# EAGLE design Pure VCF (EAGLE 9.6.2)
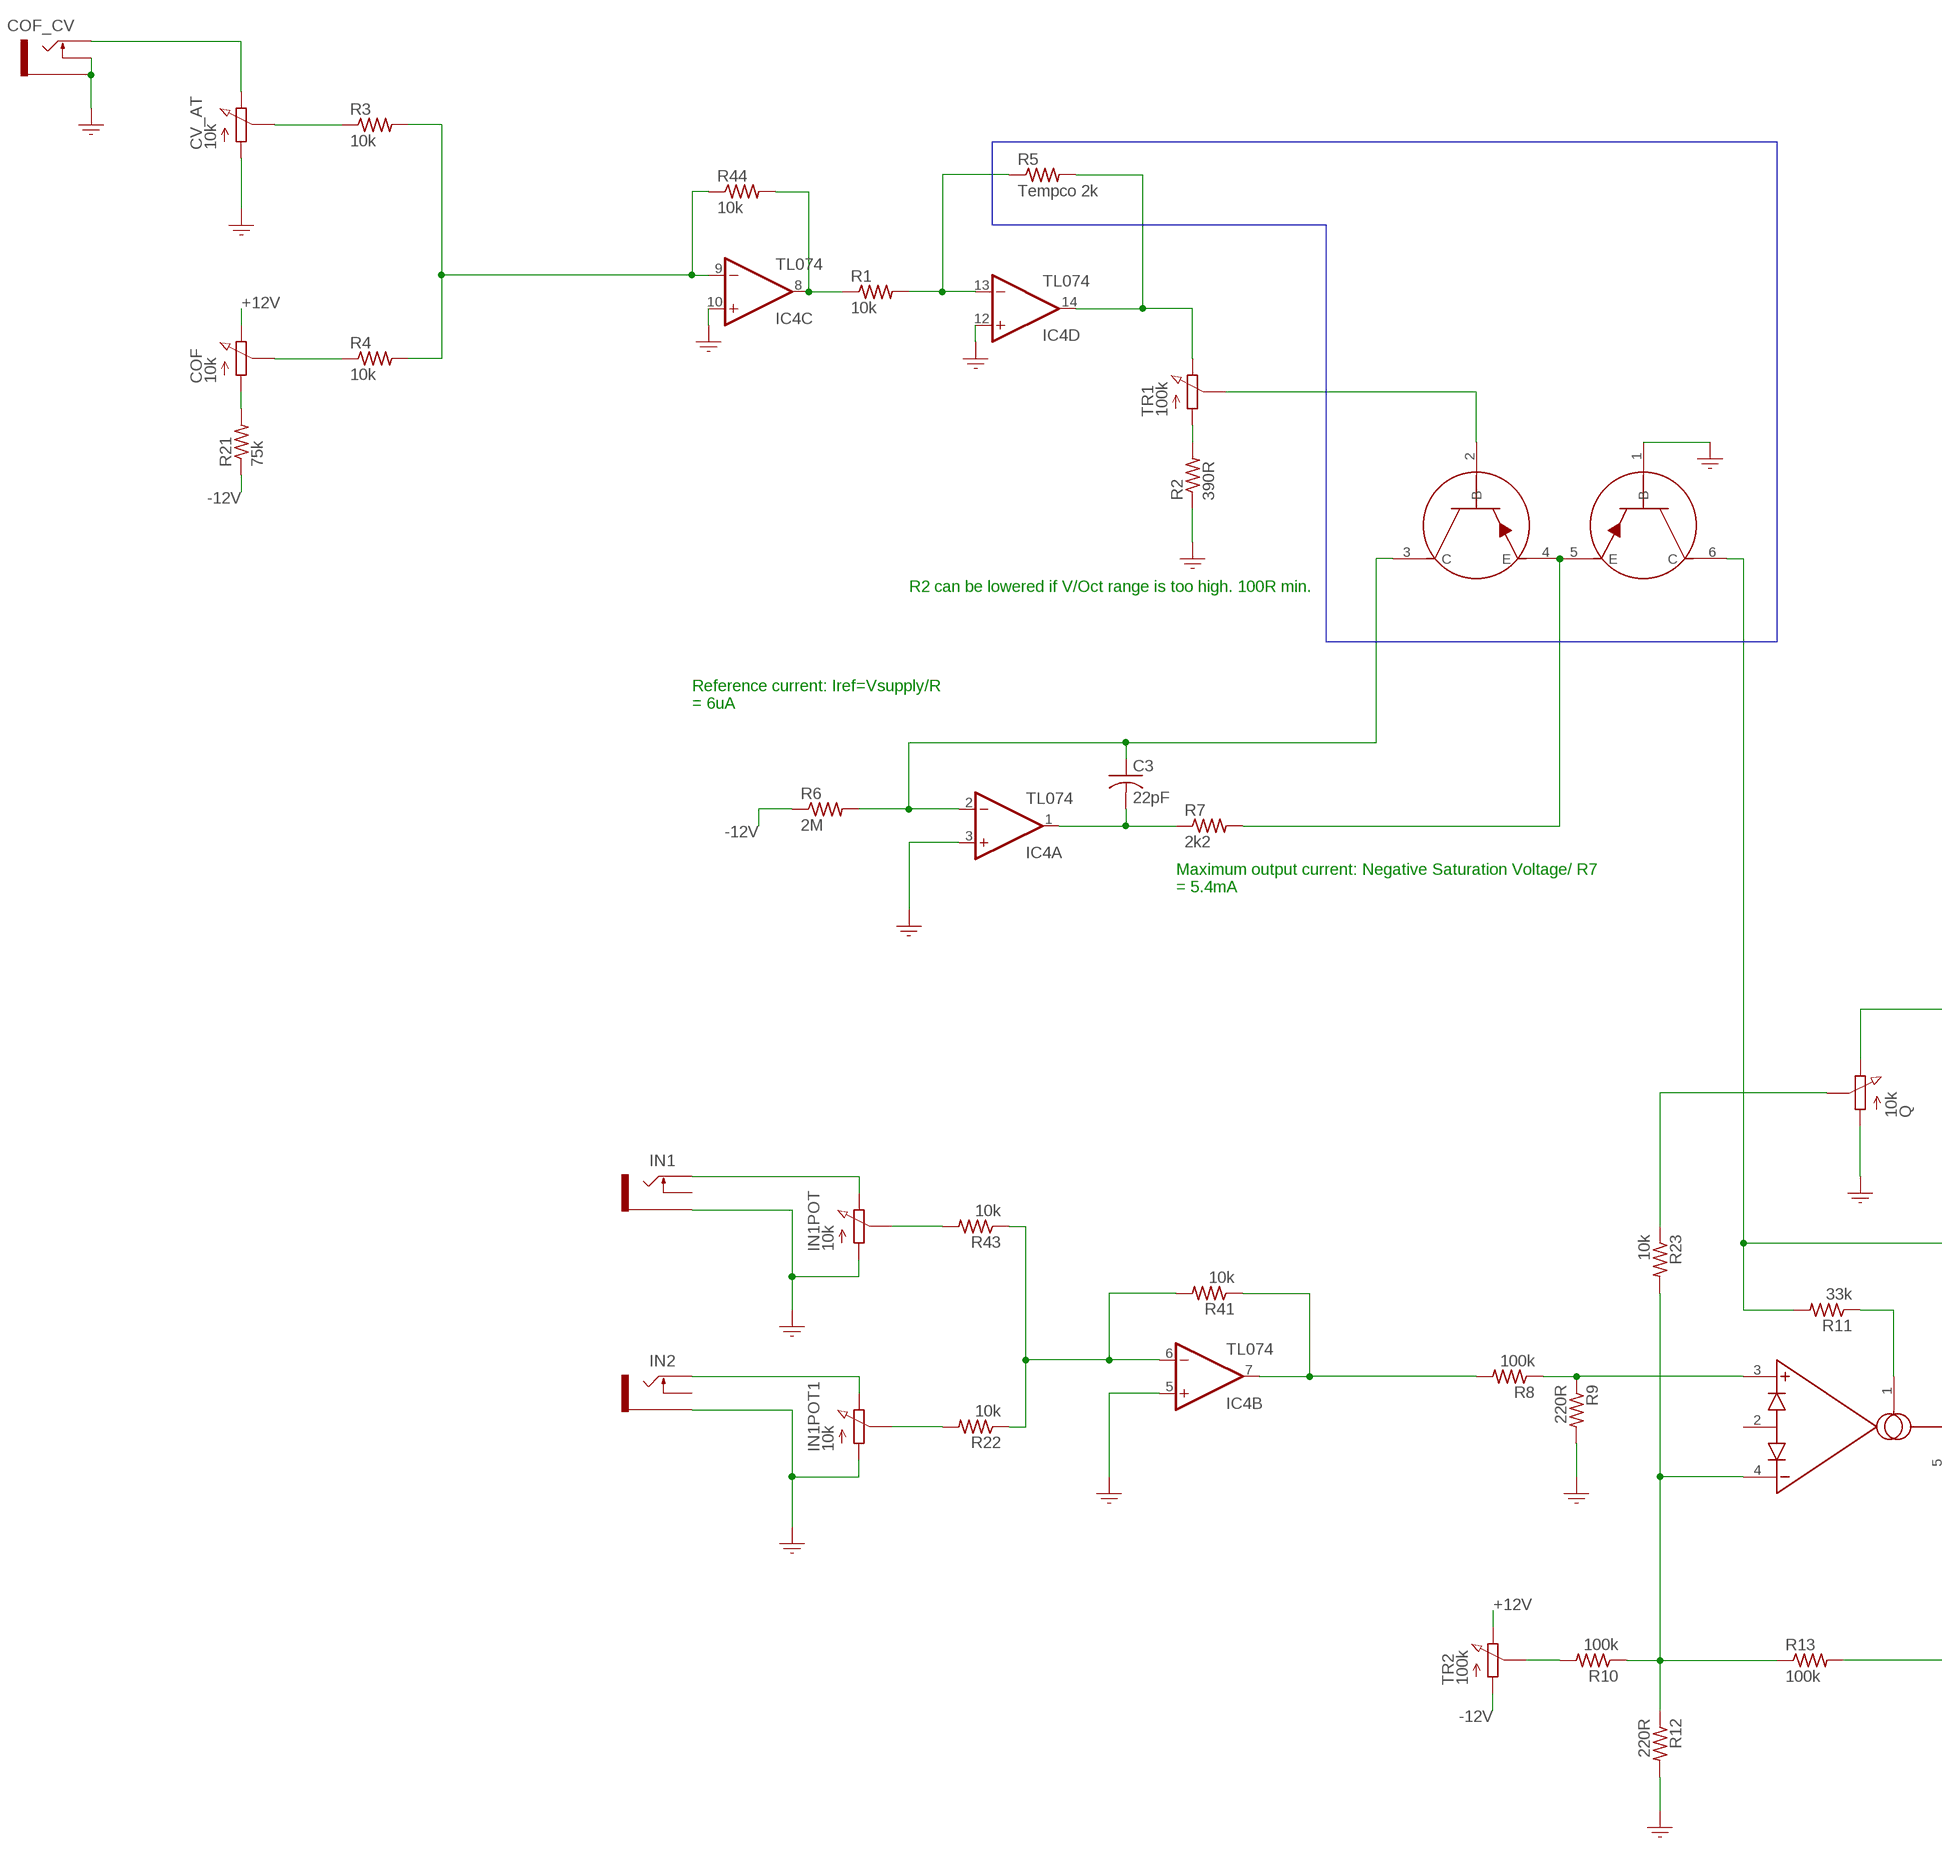
[diagram p0: schematic, sheet 1, part 1 of 2]
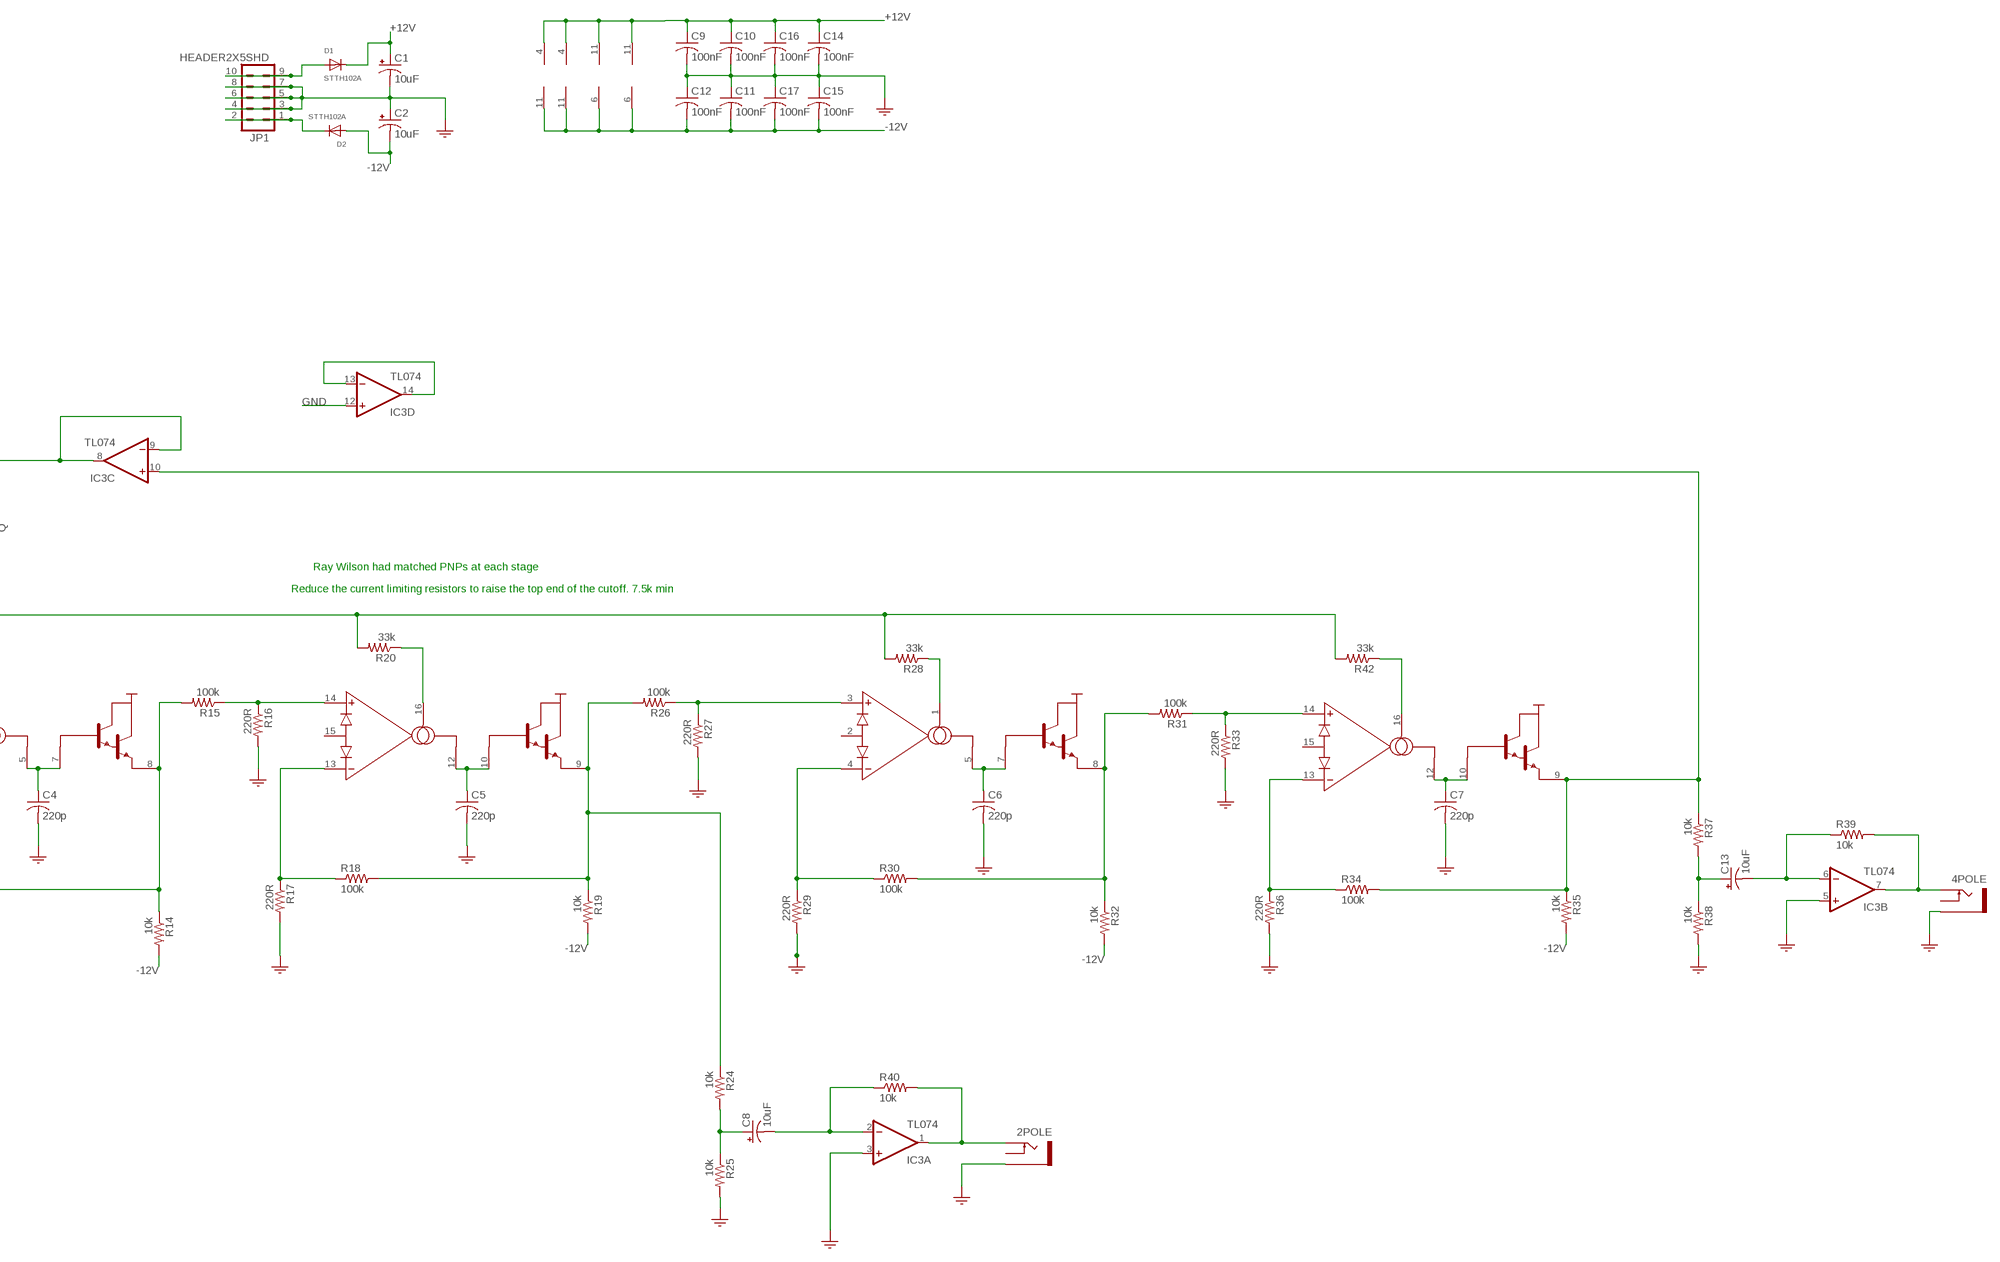
[diagram p1: schematic, sheet 1, part 2 of 2]

## Parts
2POLE  PJ301M-12  SOCKET_MONO_3.5MMPJ301M-12  [PJ301M-12]
4POLE  PJ301M-12  SOCKET_MONO_3.5MMPJ301M-12  [PJ301M-12]
C1  10uF  CAPACITOR_POL-US153CLV-0505  [153CLV-0505]
C2  10uF  CAPACITOR_POL-US153CLV-0505  [153CLV-0505]
C3  22pF  CAPACITOR-USC0805  [C0805]
C4  220p  CAPACITOR-USC050-045X075  [C050-045X075]
C5  220p  CAPACITOR-USC050-045X075  [C050-045X075]
C6  220p  CAPACITOR-USC050-045X075  [C050-045X075]
C7  220p  CAPACITOR-USC050-045X075  [C050-045X075]
C8  10uF  CAPACITOR_POL-US153CLV-0505  [153CLV-0505]
C9  100nF  CAPACITOR-USC0805  [C0805]
C10  100nF  CAPACITOR-USC0805  [C0805]
C11  100nF  CAPACITOR-USC0805  [C0805]
C12  100nF  CAPACITOR-USC0805  [C0805]
C13  10uF  CAPACITOR_POL-US153CLV-0505  [153CLV-0505]
C14  100nF  CAPACITOR-USC0805  [C0805]
C15  100nF  CAPACITOR-USC0805  [C0805]
C16  100nF  CAPACITOR-USC0805  [C0805]
C17  100nF  CAPACITOR-USC0805  [C0805]
COF  10k  RESISTOR_VARIABLEPOT_9MM_RED_KNOB  [POT_9MM_RED_KNOB]
COF_CV  PJ301M-12  SOCKET_MONO_3.5MMPJ301M-12  [PJ301M-12]
CV_AT  10k  RESISTOR_VARIABLEPOT_9MM_GREEN_KNOB  [POT_9MM_GREEN_KNOB]
D1  STTH102A  DIODESMA  [SMADIODE]
D2  STTH102A  DIODESMA  [SMADIODE]
IC1  LM13700  OTA_LM13700  [SOIC-16_BLANK]
IC2  LM13700  OTA_LM13700  [SOIC-16_BLANK]
IC3  TL074  OPAMP_QUADD  [SO14]
IC4  TL074  OPAMP_QUADD  [SO14]
IN1  PJ301M-12  SOCKET_MONO_3.5MMPJ301M-12  [PJ301M-12]
IN1POT  10k  RESISTOR_VARIABLEPOT_9MM_BLUE_KNOB  [POT_9MM_BLUE_KNOB]
IN1POT1  10k  RESISTOR_VARIABLEPOT_9MM_BLUE_KNOB  [POT_9MM_BLUE_KNOB]
IN2  PJ301M-12  SOCKET_MONO_3.5MMPJ301M-12  [PJ301M-12]
JP1  HEADER2X5SHD  [2X5-SHROUDED]
Q  10k  RESISTOR_VARIABLEPOT_9MM_YELLOW_KNOB  [POT_9MM_YELLOW_KNOB]
R1  10k  RESISTOR_USR0805  [R0805]
R2  390R  RESISTOR_USR0805  [R0805]
R3  10k  RESISTOR_USR0805  [R0805]
R4  10k  RESISTOR_USR0805  [R0805]
R5  Tempco 2k  RESISTOR_US0207/8.5  [0207/8.5]
R6  2M  RESISTOR_USR0805  [R0805]
R7  2k2  RESISTOR_USR0805  [R0805]
R8  100k  RESISTOR_USR0805  [R0805]
R9  220R  RESISTOR_USR0805  [R0805]
R10  100k  RESISTOR_USR0805  [R0805]
R11  33k  RESISTOR_USR0805  [R0805]
R12  220R  RESISTOR_USR0805  [R0805]
R13  100k  RESISTOR_USR0805  [R0805]
R14  10k  RESISTOR_USR0805  [R0805]
R15  100k  RESISTOR_USR0805  [R0805]
R16  220R  RESISTOR_USR0805  [R0805]
R17  220R  RESISTOR_USR0805  [R0805]
R18  100k  RESISTOR_USR0805  [R0805]
R19  10k  RESISTOR_USR0805  [R0805]
R20  33k  RESISTOR_USR0805  [R0805]
R21  75k  RESISTOR_USR0805  [R0805]
R22  10k  RESISTOR_USR0805  [R0805]
R23  10k  RESISTOR_USR0805  [R0805]
R24  10k  RESISTOR_USR0805  [R0805]
R25  10k  RESISTOR_USR0805  [R0805]
R26  100k  RESISTOR_USR0805  [R0805]
R27  220R  RESISTOR_USR0805  [R0805]
R28  33k  RESISTOR_USR0805  [R0805]
R29  220R  RESISTOR_USR0805  [R0805]
R30  100k  RESISTOR_USR0805  [R0805]
R31  100k  RESISTOR_USR0805  [R0805]
R32  10k  RESISTOR_USR0805  [R0805]
R33  220R  RESISTOR_USR0805  [R0805]
R34  100k  RESISTOR_USR0805  [R0805]
R35  10k  RESISTOR_USR0805  [R0805]
R36  220R  RESISTOR_USR0805  [R0805]
R37  10k  RESISTOR_USR0805  [R0805]
R38  10k  RESISTOR_USR0805  [R0805]
R39  10k  RESISTOR_USR0805  [R0805]
R40  10k  RESISTOR_USR0805  [R0805]
R41  10k  RESISTOR_USR0805  [R0805]
R42  33k  RESISTOR_USR0805  [R0805]
R43  10k  RESISTOR_USR0805  [R0805]
R44  10k  RESISTOR_USR0805  [R0805]
T1  DMMT3906W  TRANSISTOR_PAIR_PNP  [TRANS_PAIR]
TR1  100k  RESISTOR_VARIABLETRIMMER_TH  [TRIMMER_TH]
TR2  100k  RESISTOR_VARIABLETRIMMER_TH  [TRIMMER_TH]

## Nets
+12V: C1.+ C9.1 C10.1 C14.1 C16.1 COF.P$3 D1.C IC1.11(V+) IC2.11(V+) IC3.4(P:V+) IC4.4(P:V+) TR2.3
-12V: C2.- C11.2 C12.2 C15.2 C17.2 D2.A IC1.6(V-) IC2.6(V-) IC3.11(P:V-) IC4.11(P:V-) R6.1 R14.2 R19.2 R21.1 R32.2 R35.2 TR2.1
GND: 2POLE.GND(SLEEVE) 4POLE.GND(SLEEVE) C1.- C2.+ C4.2 C5.2 C6.2 C7.2 C9.2 C10.2 C11.1 C12.1 C14.2 C15.1 C16.2 C17.1 COF_CV.GND(SLEEVE) COF_CV.NORM(SWITCH) CV_AT.P$1 IC3.3(A:+IN) IC3.5(B:+IN) IC3.12(D:+IN) IC4.3(A:+IN) IC4.5(B:+IN) IC4.10(C:+IN) IC4.12(D:+IN) IN1.GND(SLEEVE) IN1POT1.P$1 IN1POT.P$1 IN2.GND(SLEEVE) JP1.3 JP1.4 JP1.5 JP1.6 JP1.7 JP1.8 Q.P$1 R2.1 R9.2 R12.2 R16.2 R17.2 R25.2 R27.2 R29.2 R33.2 R36.2 R38.2 T1.1(B)
N$1: C5.1 IC1.10(BUF-IN_2) IC1.12(OUT)
N$2: T1.2(B) TR1.2
N$3: R2.2 TR1.1
N$4: IC1.4(IN-) R10.1 R12.1 R13.1 R23.2
N$5: IC4.14(D:OUT) R5.2 TR1.3
N$6: IC4.13(D:-IN) R1.2 R5.1
N$7: COF_CV.TIP CV_AT.P$3
N$9: CV_AT.P$2 R3.1
N$10: COF.P$2 R4.1
N$11: C3.1 IC4.2(A:-IN) R6.2 T1.3(C)
N$12: C3.2 IC4.1(A:OUT) R7.1
N$13: IC1.1(BIAS-IN) R11.1
N$14: R7.2 T1.4(E) T1.5(E)
N$15: IC4.6(B:-IN) R22.1 R41.2 R43.1
N$16: IC1.9(BUF-OUT_2) R18.2 R19.1 R24.1 R26.2
N$17: IC1.3(IN+) R8.1 R9.1
N$18: C8.- IC3.2(A:-IN) R40.1
N$19: Q.P$2 R23.1
N$20: IC3.8(C:OUT) IC3.9(C:-IN) Q.P$3
N$21: C13.- IC3.6(B:-IN) R39.1
N$22: IC1.16(BIAS-IN) R20.1
N$23: IC1.14(IN+) R15.1 R16.1
N$24: IC1.13(IN-) R17.1 R18.1
N$25: COF.P$1 R21.2
N$26: C8.+ R24.2 R25.1
N$27: C4.1 IC1.5(OUT) IC1.7(BUF-IN_2)
N$28: IC1.8(BUF-OUT_2) R13.2 R14.1 R15.2
N$29: IC2.3(IN+) R26.1 R27.1
N$30: 2POLE.TIP IC3.1(A:OUT) R40.2
N$31: IC2.16(BIAS-IN) R42.1
N$32: IC4.7(B:OUT) R8.2 R41.1
N$33: IC2.4(IN-) R29.1 R30.1
N$34: IC4.8(C:OUT) R1.1 R44.2
N$35: R11.2 R20.2 R28.2 R42.2 T1.6(C)
N$36: C13.+ R37.2 R38.1
N$37: IC3.13(D:-IN) IC3.14(D:OUT)
N$38: D1.A JP1.9 JP1.10
N$39: IC4.9(C:-IN) R3.2 R4.2 R44.1
N$40: IC2.13(IN-) R34.1 R36.1
N$41: 4POLE.TIP IC3.7(B:OUT) R39.2
N$43: IC2.14(IN+) R31.1 R33.1
N$44: IC2.8(BUF-OUT_2) R30.2 R31.2 R32.1
N$46: IC2.9(BUF-OUT_2) IC3.10(C:+IN) R34.2 R35.1 R37.1
N$47: IN1.TIP IN1POT.P$3
N$49: IN1POT1.P$3 IN2.TIP
N$50: D2.C JP1.1 JP1.2
N$53: IN1POT.P$2 R43.2
N$54: R10.2 TR2.2
N$55: IN1POT1.P$2 R22.2
N$57: C6.1 IC2.5(OUT) IC2.7(BUF-IN_2)
N$58: C7.1 IC2.10(BUF-IN_2) IC2.12(OUT)
N$59: IC2.1(BIAS-IN) R28.1
Unconnected: 2POLE.NORM(SWITCH) 4POLE.NORM(SWITCH) IC1.2(D-BIAS) IC1.15(D-BIAS) IC2.2(D-BIAS) IC2.15(D-BIAS) IN1.NORM(SWITCH) IN2.NORM(SWITCH)

## Buses
B$1

## Notes on the sheet
- R2 can be lowered if V/Oct range is too high. 100R min.
- Reference current: Iref=Vsupply/R
  = 6uA
- Maximum output current: Negative Saturation Voltage/ R7
  = 5.4mA
- Ray Wilson had matched PNPs at each stage
- Reduce the current limiting resistors to raise the top end of the cutoff. 7.5k min

## Library data of the parts
2POLE 4POLE COF_CV IN1 IN2 = GMSN:SOCKET_MONO_3.5MM: 3.5 mm Jack Socket; SORT: 8
C1 C2 C8 C13 = GMSN:CAPACITOR_POL-US: Electro Capacitor; SORT: 3
C3 C9-C12 C14-C17 = GMSN:CAPACITOR-US: Capacitor; SORT: 3
C4-C7 = GMSN:CAPACITOR-US: Capacitor; SORT: 5
COF CV_AT IN1POT IN1POT1 Q = GMSN:RESISTOR_VARIABLE: Pot; SORT: 8
D1 D2 = GMSN:DIODE: Diode SMADIODE - SMA Surface Mount Package 20V 1A Schottky Diode Digikey: 641-1014-6-ND DO-1N4148 - Through Hole Small Current Diode SOD-123 20V 1 A (.5mV Vf) Schottky Diode - Digikey: MBRX120TPMSCT-ND SOD-323 10V 570mA (.38mV Vf, 3ns) Schottky Diode - Digikey: ZLLS410CT-ND SOD-523 30V 30mA Schottky Diode (RB751S-40TE61) - Digikey: RB751S-40TE61CT-ND SOT23-R/W - SOT23 Package (R = Solder Paste/Reflow Ovens, W = Hand-Soldering) BAT54Film 40V 300mA - Digikey: 497-7162-1-ND; SORT: 3.9
IC1 IC2 = GMSN:OTA_LM13700: LM13700 OTA; SORT: 4.5
IC3 IC4 = GMSN:OPAMP_QUAD: OP AMP; SORT: 4.5
JP1 = GMSN:HEADER2X5: Header 5x2 Standard 10-pin dual row 0.1" header. Commonly used with AVR-ISP. Use with Spark Fun Electronics SKU: PRT-00778; SORT: 7
R1-R44 = GMSN:RESISTOR_US: Resistor; SORT: 2
T1 = GMSN:TRANSISTOR_PAIR_PNP: PNP Matched Transistor Pair; SORT: 4.1
TR1 TR2 = GMSN:RESISTOR_VARIABLE: Pot; SORT: 7

## Board
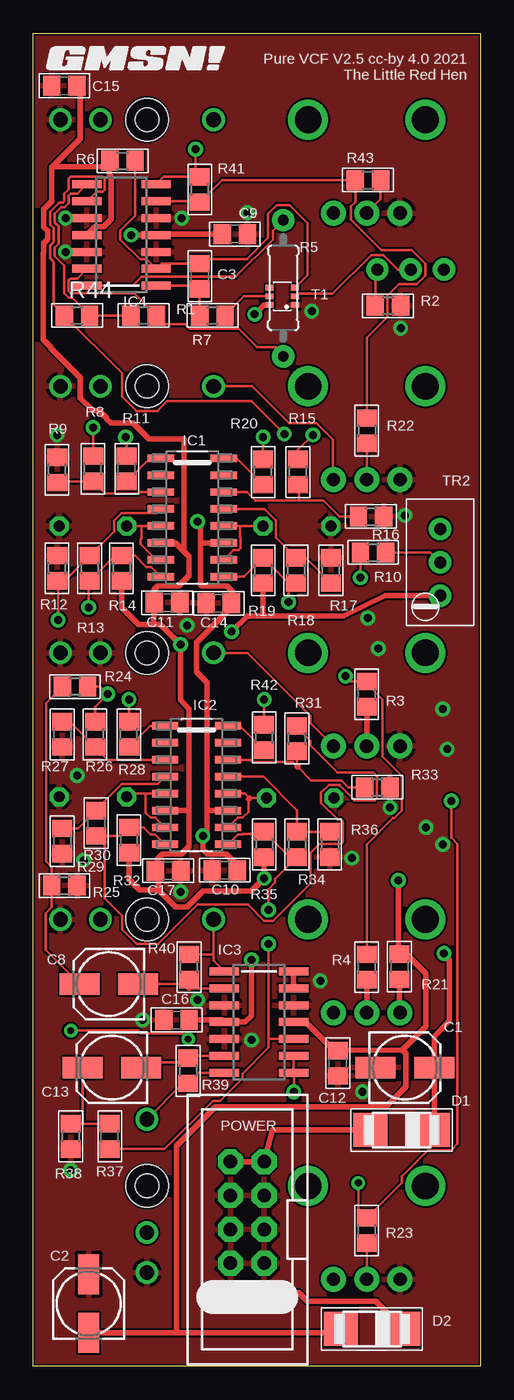
[diagram p2: board, top side]
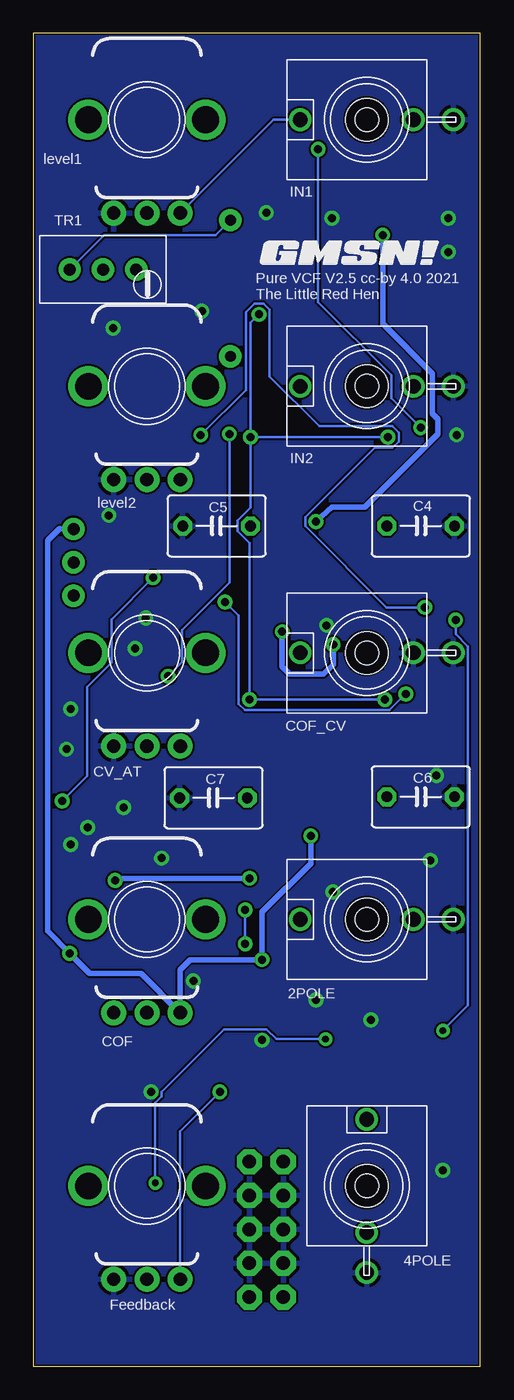
[diagram p3: board, bottom side, seen from below]

Size 33.56 x 100 mm. Coordinates in mm from the lower left corner, seen from the top.
Outline: 33.56,0 0,0 0,100 33.56,100 33.56,0
Copper layers (1*16): Top 0.035mm / dielectric 1.5mm / Bottom 0.035mm
Design rules "PCBWay": minimum track width 6mil, minimum drill 12mil, track to track 6mil, track to pad 6mil, pad to pad 6mil, via to via 6mil, smd to smd 6mil, copper to edge 6mil, drill to drill 6mil, minimum pad ring 12mil, minimum via ring 10mil, stop-mask expansion 4mil, vias tented up to drill 25mil, thermal gap 10mil
Holes 3.2 mm at 8.53,93.52 8.53,73.52 8.53,53.52 8.53,33.52 8.53,13.52

### Footprints (pad centres in the part's own frame; a part is rotated, then mirrored left to right if it is on the bottom)
PJ301M-12 = drill 1.1: GND 0,-6.5; NORM 0,-3.5; TIP 0,5 | hole 1.778: 0,0
153CLV-0505 = smd 3 x 1.6: + 2.2,0; - -2.2,0
C0805 = smd 1.3 x 1.5: 1 -0.95,0; 2 0.95,0
C050-045X075 = drill 0.813 octagon: 1 -2.54,0; 2 2.54,0
POT_9MM_RED_KNOB = drill 1 pad 1.88: P$1 -2.5,-7; P$2 0,-7; P$3 2.5,-7 | drill 2 pad 2.68: P$4 -4.4,0; P$5 4.4,0
POT_9MM_GREEN_KNOB = drill 1 pad 1.88: P$1 -2.5,-7; P$2 0,-7; P$3 2.5,-7 | drill 2 pad 2.68: P$4 -4.4,0; P$5 4.4,0
SMADIODE = smd 2.54 x 2.54: A 2.349,0; C -2.349,0
SOIC-16_BLANK = smd 1.981 x 0.559: 1 -2.362,4.445; 2 -2.362,3.175; 3 -2.362,1.905; 4 -2.362,0.635; 5 -2.362,-0.635; 6 -2.362,-1.905; 7 -2.362,-3.175; 8 -2.362,-4.445; 9 2.362,-4.445; 10 2.362,-3.175; 11 2.362,-1.905; 12 2.362,-0.635; 13 2.362,0.635; 14 2.362,1.905; 15 2.362,3.175; 16 2.362,4.445
SO14 = smd 0.6 x 2.2: 1 -3.81,-2.6; 2 -2.54,-2.6; 3 -1.27,-2.6; 4 0,-2.6; 5 1.27,-2.6; 6 2.54,-2.6; 7 3.81,-2.6; 8 3.81,2.6; 9 2.54,2.6; 10 1.27,2.6; 11 0,2.6; 12 -1.27,2.6; 13 -2.54,2.6; 14 -3.81,2.6
POT_9MM_BLUE_KNOB = drill 1 pad 1.88: P$1 -2.5,-7; P$2 0,-7; P$3 2.5,-7 | drill 2 pad 2.68: P$4 -4.4,0; P$5 4.4,0
2X5-SHROUDED = drill 1.016 pad 1.88 octagon: 1 -1.27,5.08; 2 1.27,5.08; 3 -1.27,2.54; 4 1.27,2.54; 5 -1.27,0; 6 1.27,0; 7 -1.27,-2.54; 8 1.27,-2.54; 9 -1.27,-5.08; 10 1.27,-5.08
POT_9MM_YELLOW_KNOB = drill 1 pad 1.88: P$1 -2.5,-7; P$2 0,-7; P$3 2.5,-7 | drill 2 pad 2.68: P$4 -4.4,0; P$5 4.4,0
R0805 = smd 1.3 x 1.5: 1 -0.95,0; 2 0.95,0
0207/8.5 = drill 0.813 pad 1.676: 1 -5.139,0; 2 5.08,0
TRANS_PAIR = smd 0.42 x 0.6: 1 -0.65,-0.95; 2 0,-0.95; 3 0.65,-0.95; 4 0.65,0.95; 5 0,0.95; 6 -0.65,0.95
TRIMMER_TH = drill 0.9 pad 1.676: 1 -0.802,1.143; 2 -3.302,1.143; 3 -5.802,1.143

### Placement (x,y rotation side)
2POLE  8.53,33.52 90 bottom
4POLE  8.53,13.52 0 bottom
C1  27.89,22.4 0 top
C2  4.16,4.7 90 top
C3  12.49,81.77 270 top
C4  4.48,63.04 0 bottom
C5  19.8,63.04 180 bottom
C6  4.48,42.72 0 bottom
C7  20.03,42.64 180 bottom
C8  5.67,28.67 180 top
C9  15.12,84.94 0 top
C10  14.37,37.21 180 top
C11  10.05,57.28 180 top
C12  22.86,22.73 90 top
C13  5.91,22.4 180 top
C14  13.92,57.25 180 top
C15  2.33,96.06 0 top
C16  10.75,25.97 180 top
C17  10.11,37.17 180 top
COF  25.03,33.52 0 bottom
COF_CV  8.53,53.52 90 bottom
CV_AT  25.03,53.52 0 bottom
D1  27.65,17.72 180 top
D2  25.43,2.8 180 top
IC1  11.94,63.68 0 top
IC2  12.26,43.59 0 top
IC3  16.94,25.82 270 top
IC4  6.62,84.87 90 top
IN1  8.53,93.52 90 bottom
IN1POT  25.03,93.52 0 bottom
IN1POT1  25.03,73.52 0 bottom
IN2  8.53,73.52 90 bottom
JP1  16.07,10.26 180 top
Q  25.03,13.52 0 bottom
R1  8.29,78.84 0 top
R2  26.62,79.55 180 top
R3  25.04,50.42 90 top
R4  25.04,29.94 90 top
R5  18.76,80.9 90 top
R6  6.7,90.43 0 top
R7  13.45,78.84 0 top
R8  4.48,67.33 90 top
R9  1.78,67.25 90 top
R10  25.51,61.06 0 top
R11  7.02,67.33 90 top
R12  1.78,59.87 90 top
R13  4.24,59.87 270 top
R14  6.62,59.87 270 top
R15  19.88,67.09 90 top
R16  25.35,63.76 0 top
R17  22.34,59.71 90 top
R18  19.72,59.71 270 top
R19  17.26,59.71 270 top
R20  17.26,67.09 90 top
R21  27.49,29.97 270 top
R22  25.04,70.19 270 top
R23  25.04,10.18 90 top
R24  3.13,50.98 180 top
R25  2.33,36.05 0 top
R26  4.64,47.41 90 top
R27  2.17,47.41 270 top
R28  7.18,47.41 90 top
R29  2.17,39.39 270 top
R30  4.71,40.74 270 top
R31  19.8,47.09 90 top
R32  7.18,39.47 270 top
R33  25.83,43.44 0 top
R34  19.8,39.15 270 top
R35  17.34,39.15 270 top
R36  22.26,39.15 270 top
R37  5.75,17.24 90 top
R38  2.81,17.24 270 top
R39  11.62,22.16 270 top
R40  11.7,29.94 90 top
R41  12.49,88.28 270 top
R42  17.34,47.17 90 top
R43  25.11,89 0 top
R44  3.29,78.84 0 top
T1  18.68,80.27 90 top
TR1  25.02,81.14 0 bottom
TR2  29.4,57.01 270 top
U$1  [GMSN!_LOGO]  9.56,83.44 0 bottom
U$2  [GMSN!_LOGO]  7.97,98.05 0 top

### Tracks (layer width: path | path; a pad name or v marks a point on that pad's centre or on a via)
+12V  (via drill 0.6)
  Top 0.406: 13.05,41.69 13.05,51.29 12.26,52.09 12.26,54.31 14.64,56.69 14.64,56.96 C14.1 14.92,58.15 14.56,58.52 12.65,58.52 12.57,58.6 12.57,61.77 | C16.1 14.18,25.97 IC3.4 15.91,25.82 16.38,26.29 v16.38,30.5 | D1.C 30.09,17.81 C1.+ 30.09,24.76 31.23,25.89 31.23,30.5 30.83,30.89 v30.83,30.97 | 12.57,61.77 12.57,62.96 12.18,63.36 v12.34,63.36 | v7.33,84.87 IC4.4 9.29,84.94 C9.1 | C10.1 15.37,37.54 14.48,38.44 13.05,38.44 12.73,38.75 v12.73,39.78 13.05,40.11 13.05,41.69 | IC1.11 12.57,61.77 | 13.05,41.69 IC2.11
  Bottom 0.406: TR2.3 31.59,62.83 32.5,61.93 32.5,35.42 32.5,32.64 v30.83,30.97 29.32,29.47 25.48,29.47 COF.P$3 22.53,29.75 21.78,30.5 v16.38,30.5 16.38,34.07 12.73,37.72 v12.73,39.78 | v7.33,84.87 7.33,78.2 3.6,74.47 3.6,71.46 3.21,71.06 3.21,69.95 8.68,64.47 11.14,64.47 v12.34,63.36
-12V  (via drill 0.6)
  Top 0.406: 11.7,41.69 11.7,49.31 11.05,49.96 v11.05,54.15 9.54,55.66 9.16,55.66 | R35.2 v17.34,36.61 16.38,35.66 12.73,35.66 11.54,34.47 10.67,34.47 9.4,35.74 | R32.2 7.18,36.53 7.97,35.74 9.4,35.74 | TR2.1 26.42,57.81 23.29,56.3 17.26,56.3 | v14.88,55.1 16.07,56.3 17.26,56.3 | 17.26,56.3 R19.2 | R14.2 6.62,56.93 7.89,55.66 9.16,55.66 | C2.- 10.83,2.5 | 10.83,2.5 22.79,2.5 D2.A | IC3.11 20.43,25.82 22.52,23.73 C12.2 27.71,23.73 | v27.42,36.45 27.42,30.99 R21.1 27.59,30.82 28.13,30.82 29.48,29.47 29.48,25.5 27.71,23.73 | 27.71,23.73 27.97,23.47 27.97,20.97 26.46,19.46 13.68,19.46 10.75,16.53 10.75,2.58 10.83,2.5 | 9.16,55.66 9.05,55.77 C11.2 9.08,57.32 9.08,58.28 9.32,58.52 10.91,58.52 11.7,59.31 11.7,60.74 11.3,61.14 | 1.43,90 3.52,92.09 3.52,95.87 C15.2 | 9.4,35.74 9.4,37.28 C17.2 9.32,37.53 9.32,38.04 9.72,38.44 11.14,38.44 11.7,38.99 11.7,41.69 | 11.7,41.69 IC2.6 | 1.43,90 5.32,90 R6.1 5.75,89.35 5.83,89.27 5.83,86.05 5.27,85.48 4.63,85.48 IC4.11 | 1.43,90 1.38,89.95 1.38,87.39 0.8,86.81 0.8,85.47 1.08,85.19 1.08,84.55 0.8,84.27 0.8,83.57 0.75,83.52 0.75,77.01 1.3,76.46 1.3,76.38 3.52,74.15 3.52,72.65 4.48,71.69 4.95,71.69 5.51,71.14 5.51,71.06 5.83,70.74 7.49,70.74 8.68,69.55 11.3,69.55 11.3,61.14 | IC1.6 10.67,61.77 11.3,61.14
  Bottom 0.406: v17.34,36.61 27.26,36.61 v27.42,36.45 | v14.88,55.1 14.88,52.48 14.32,51.93 11.76,51.93 11.05,52.64 v11.05,54.15
GND  (via drill 0.6)
  other vias: 24.72,20.58 30.75,49.31 31.07,46.29 29.48,40.42 30.75,39.15 25.11,56.14 25.91,53.83 16.38,24.47 21.54,28.91 3.29,44.31 11.54,55.58 11.06,35.58 2.41,86.14 2.41,83.6 11.14,86.14 16.07,86.54 27.57,77.88 20.91,79.16 1.78,69.87 27.89,63.84 3.76,37.96 23.92,38.12 26.78,41.93 12.34,27.48 8.21,25.97 2.81,14.7
  pour Top: -1,100.11 34.56,100.11 34.56,-0.22 -1,-0.22
  pour Bottom: -1,100.11 34.56,100.11 34.56,-0.22 -1,-0.22
N$1
  Top 0.2: IC1.12 15.51,63.04 | 15.51,63.04 C5.1 | IC1.10 15.04,61.24 15.39,61.24 15.54,61.39 15.54,62.16 15.51,62.19 15.51,63.04
N$2
  Top 0.2: T1.2 19.82,80.45 22.46,80.45 25.38,83.37 26.28,83.37 27.37,82.28 TR1.2
N$3
  Top 0.2: R2.2 25.67,82.13 TR1.1
N$4  (via drill 0.51, 0.6)
  Top 0.2: IC1.4 9.27,64 6.62,64 6.05,63.44 6.05,62.63 R13.1 | R13.1 2.26,58.84 1.86,58.84 v1.86,55.98 | R12.1 2.34,58.92 R13.1 | v24.56,59.15 R10.1 | v31.38,42.4 31.38,39.66 31.84,39.2 31.84,16.66 31.38,16.2 29.63,16.2 27.68,14.25 27.68,13.77 R23.2 24.4,11.76 v24.4,13.75 | v11.62,24.54 11.19,24.97 8.07,24.97 7.86,25.18 v2.81,25.18
  Top 0.406: 1.86,58.84 R12.1
  Bottom 0.2: v1.86,55.98 1.86,54.91 0.92,53.98 0.92,51.77 0.92,51.52 0.92,27.07 v2.81,25.18 | v31.38,42.4 29.52,44.27 29.52,50.95 27.68,52.79 27.68,56.03 v24.56,59.15 | v24.4,13.75 24.4,19.75 23.91,20.24 23.91,20.59 19.23,25.27 16.05,25.27 15.32,24.54 v11.62,24.54
N$5
  Top 0.2: R5.2 17.98,85.19 17.98,84.51 15.2,81.73 8.13,81.73 7.46,81.06 IC4.14
  Bottom 0.2: 21.86,84.87 28.24,84.87 TR1.3
  Bottom 0.203: 21.86,84.87 19.88,84.87 R5.2
N$6
  Top 0.2: R5.1 18.07,76.46 16.78,76.46 15.4,77.83 11.74,77.83 11.38,78.2 9.88,78.2 R1.2 7.57,80.51 2.81,80.51 2.67,80.66 2.67,81.46 2.81,81.61 3.3,81.61 IC4.13
  Top 0.203: 16.78,76.46 18.22,76.46 18.75,75.93
  Top 0.406: R5.1 18.75,75.93
N$7
  Top 0.2: CV_AT.P$3 20.8,48.25 20.8,48.79 16.07,53.52 COF_CV.TIP
N$9
  Top 0.406: R3.1 CV_AT.P$2
N$10
  Top 0.406: R4.1 COF.P$2
N$11
  Top 0.2: R6.2 7.65,86.33 6.53,85.2 6.53,84.53 8.02,83.05 8.5,83.05 IC4.2 9.61,82.72 C3.1 12.84,83.07 16.04,83.07 | T1.3 20.59,81.87 20.59,82.33
  Top 0.203: 16.04,83.07 17.62,84.65 17.62,86.45 18.29,87.12 19.24,87.12 20.59,85.77 20.59,82.33
N$12
  Top 0.2: IC4.1 12.26,81.06 C3.2 R7.1
N$13
  Top 0.2: R11.1 8.76,68.12 IC1.1
N$14
  Top 0.2: R7.2 15.82,80.27 T1.5 T1.4
N$15
  Top 0.2: IC4.6 12.42,87.41 R41.2 14.16,89 R43.1 24.16,87.34 23.84,87.01 23.84,86.03 26.14,83.72 28.43,83.72 29.42,82.73 29.42,81.83 28.78,81.19 27.45,81.19 26.57,80.31 26.57,78.7 25.04,77.16 R22.1
N$16  (via drill 0.6)
  Top 0.2: IC1.9 15.83,59.23 17.18,60.58 | R19.1 19.16,58.76 R18.2 19.16,58.2 v19.16,57.33 | R24.1 5.03,50.98 v5.59,50.42 4.64,49.47 R26.2
  Top 0.406: 17.18,60.58 R19.1
  Bottom 0.2: v5.59,50.42 5.64,50.42 6.84,49.22 17.67,49.22 18.14,49.69 18.14,56.31 v19.16,57.33
N$17
  Top 0.2: IC1.3 7.98,65.58 7.87,65.48 5.38,65.48 R8.1 1.86,66.38 R9.1
N$18
  Top 0.2: IC3.2 11.7,28.36 | C8.- 11.7,28.67
  Top 0.406: R40.1 11.7,28.67 11.7,28.36
N$19
  Top 0.2: R23.1 Q.P$2
  Top 0.406: Q.P$2
N$20  (via drill 0.6)
  Top 0.2: IC3.9 IC3.8 19.56,21.99 v19.56,20.58
  Bottom 0.2: Q.P$3 22.53,17.6 v19.56,20.58
N$21
  Top 0.2: R39.1 11.78,23.28 IC3.6 | C13.- 8.5,22.8 11.62,22.8
  Top 0.406: 11.62,22.8 R39.1
N$22
  Top 0.2: IC1.16 15.27,68.12 R20.1
N$23
  Top 0.2: IC1.14 16.06,65.58 16.69,64.95 19.95,64.95 | R15.1 19.95,66.06 19.95,64.95 | R16.1 22.98,63.76 21.79,64.95 19.95,64.95
N$24
  Top 0.2: IC1.13 17.35,64.31 18.22,63.44 18.22,62.16 R18.1 20.44,60.66 R17.1
N$25
  Top 0.406: R21.2 27.49,26.56 COF.P$1
N$26
  Top 0.2: C8.+ 0.92,31.22 0.92,33.98 1.38,34.44 R25.1 1.38,37.47 0.97,37.88 0.97,49.77 R24.2
N$27
  Top 0.2: C4.1 8.13,63.04 | IC1.5 8.13,63.04 | IC1.7 9.22,60.5 8.05,61.67 8.05,62.01 8.13,62.09 8.13,63.04
N$28  (via drill 0.6)
  Top 0.2: v4.16,56.93 4.16,58.84 | R13.2 6.14,60.82 R14.1 7.63,60.82 8.48,59.97 8.84,59.97 IC1.8 | R15.2 19.88,68.76 v20.99,69.87
  Top 0.406: 4.16,58.84 R13.2
  Bottom 0.2: v4.16,56.93 7.05,56.93 13.14,63.02 13.14,63.69 7.93,68.9 6.6,68.9 6.13,69.38 6.13,70.04 6.6,70.52 12.09,70.52 15.82,74.24 15.82,79.25 16.29,79.72 16.95,79.72 17.61,79.07 17.61,73.25 v20.99,69.87
N$29
  Top 0.2: R27.1 2.74,48.35 R26.1 5.59,45.5 IC2.3
N$30
  Top 0.2: R40.2 13.53,30.89 | 2POLE.TIP 13.53,30.89 | IC3.1 13.53,30.43 13.53,30.89
N$31
  Top 0.2: IC2.16 15.51,48.04 R42.1
N$32  (via drill 0.6)
  Top 0.2: IC4.7 9.77,89.23 R41.1 12.18,89.55 v12.18,91.3 | v4.48,70.42 R8.2
  Bottom 0.2: v4.48,70.42 6.68,72.62 6.68,74.35 12.18,79.85 v12.18,91.3
N$33
  Top 0.2: IC2.4 9.35,43.69 6.62,43.69 4.71,41.78 R30.1 | R30.1 3.37,40.34 R29.1
  Top 0.406: R30.1
N$34
  Top 0.2: R1.1 R44.2 2.92,80.16 2.67,80.16 2.31,80.51 2.31,81.06 2.31,82.38 2.31,82.56 1.61,83.27 1.61,83.93 1.89,84.22 1.89,85.52 1.61,85.81 1.61,86.47 2.08,86.95 2.37,86.95 2.67,87.24 2.67,87.81 2.81,87.96 3.3,87.96 IC4.8
N$35  (via drill 0.6)
  Top 0.2: v6.94,69.71 7.02,69.63 R11.2 | R20.2 v17.26,69.71 | R28.2 v7.18,50.02 | R42.2 v17.34,50.02
  Top 0.406: T1.6 17.32,79.62 v16.62,78.92
  Bottom 0.2: v6.94,69.71 v17.26,69.71 | v16.62,78.92 17.26,78.28 v17.26,69.71 | v17.26,69.71 17.26,64.41 18.22,63.44 18.22,62.64 17.34,61.76 v17.34,50.02 v7.18,50.02
N$36
  Top 0.2: R38.1 3.68,18.19 | 3.68,18.19 R37.2 | 3.68,18.19 3.71,18.21 C13.+
N$37
  Top 0.406: IC3.14 IC3.13
N$38
  Top 0.406: JP1.10 JP1.9 17.97,17.72 D1.A
N$39  (via drill 0.6)
  Top 0.2: R4.2 25.04,39.15 27.01,41.12 27.11,41.12 27.68,41.69 27.68,44.29 26.22,45.75 26.22,50.04 25.04,51.22 R3.2 23.85,51.37 v23.45,51.77 | v18.84,69.95 16.38,72.41 10.04,72.41 9.3,71.67 7.76,71.67 6.68,72.75 6.68,74.5 R44.1 1.54,79.63 1.54,82.83 1.25,83.12 1.25,84.08 1.54,84.37 1.54,85.37 1.25,85.66 1.25,86.62 1.93,87.3 2.22,87.3 2.31,87.39 2.31,87.96 2.67,88.31 2.67,89.08 2.81,89.23 4.16,89.23 4.16,89.24 4.16,89.23 5.22,89.23 5.37,89.08 5.37,88.27 5.22,88.13 4.74,88.13 IC4.9
  Bottom 0.2: v23.45,51.77 22.38,52.84 22.38,55.25 18.84,58.78 v18.84,69.95
N$40
  Top 0.2: 19.8,40.42 19.8,41.7 17.27,44.23 IC2.13 | R34.1 R36.1
  Top 0.406: 19.8,40.42 R34.1
N$41
  Top 0.2: 4POLE.TIP 11.22,21.21 R39.2 12.41,22 IC3.7
N$43
  Top 0.2: IC2.14 16.3,45.5 16.48,45.31 19.51,45.31 19.8,45.02 R31.1 | R33.1 23.64,43.44 23.12,43.96 20.86,43.96 19.88,44.94
  Top 0.406: 19.88,44.94 19.8,45.02
N$44
  Top 0.2: IC2.8 9.15,39.89 8.8,39.89 8.27,40.42 R32.1 6.54,39.78 5.35,39.78 5.35,35.1 6.68,33.77 6.68,32.75 7.76,31.67 9.39,31.67 12.35,34.63 16.11,34.63 17.32,33.42 17.99,33.42 20.8,36.23 20.8,38.5 21.5,39.2 23.11,39.2 23.26,39.34 23.26,40.86 23.11,41 22.85,41 21.61,42.24 21.61,43.04 22.18,43.61 22.97,43.61 23.98,42.6 23.98,42.58 24.12,42.43 25.63,42.43 25.78,42.58 25.78,44.29 25.55,44.53 22.84,44.53 20.8,46.56 20.8,46.89 19.8,47.89 R31.2
  Top 0.406: 5.35,39.78 R30.2
N$46  (via drill 0.6)
  Top 0.2: IC2.9 15.36,39.89 15.71,39.89 15.77,39.94 17.49,39.94 19.24,38.2 R34.2 18.14,36.55 18.14,36.28 17.65,35.79 v17.65,34.23 | R37.1 9.87,16.29 13.5,19.92 14.01,19.92 15.69,21.6 15.69,21.95 17.65,23.91 17.65,24.54 | v17.65,31.69 17.65,24.54 | IC3.10 17.65,24.54
  Top 0.406: 17.49,39.94 R35.1
  Bottom 0.2: v17.65,34.23 v17.65,31.69
N$47
  Bottom 0.2: IN1POT.P$3 15.53,93.52 IN1.TIP
N$49
  Top 0.2: IN2.TIP 16.41,73.52 19.18,70.75 21.24,70.75 22.5,69.5 22.5,66.55 IN1POT1.P$3
N$50
  Top 0.406: D2.C 25.72,4.86 20.59,4.86 19.95,5.5 15.91,5.5 JP1.1 JP1.2
N$53
  Top 0.2: R43.2 26.06,87.55 IN1POT.P$2
N$54
  Top 0.2: R10.2 29.8,61.06 TR2.2
N$55
  Top 0.2: IN1POT1.P$2 R22.2
N$57
  Top 0.2: C6.1 7.26,42.96 8.45,42.96 | IC2.5 8.45,42.96 | IC2.7 9.15,41.16 8.8,41.16 8.45,41.51 8.45,42.96
N$58
  Top 0.2: C7.1 16.22,42.64 15.91,42.96 IC2.12 | IC2.10 15.36,41.16 15.71,41.16 16.14,41.59 16.14,42.56
  Top 0.406: 16.14,42.56 16.22,42.64
N$59
  Top 0.2: R28.1 8.76,48.04 IC2.1

### Text on the board
tPlace: Pure VCF V2.5 cc-by 4.0 2021 / The Little Red Hen | T1 | POWER
bPlace: level1 | Pure VCF V2.5 cc-by 4.0 2021 / The Little Red Hen | level2 | CV_AT | COF | Feedback